# Altium schematic sheet CLAVIER.SchDoc
size A
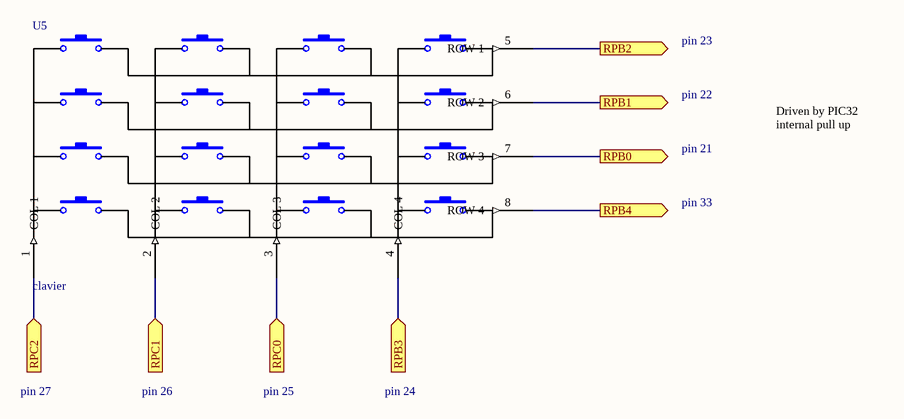
[diagram p0: CLAVIER.SchDoc]

## Parts
U5  clavier  [keypad]

## Ports
RPB0 (out), RPB1 (out), RPB2 (out), RPB3 (in), RPB4 (out), RPC0 (in), RPC1 (in), RPC2 (in)

## Nets
RPB0: U5.7(ROW_3) ; port RPB0
RPB1: U5.6(ROW_2) ; port RPB1
RPB2: U5.5(ROW_1) ; port RPB2
RPB3: U5.4(COL_4) ; port RPB3
RPB4: U5.8(ROW_4) ; port RPB4
RPC0: U5.3(COL_3) ; port RPC0
RPC1: U5.2(COL_2) ; port RPC1
RPC2: U5.1(COL_1) ; port RPC2

## Notes on the sheet
- pin 23
- pin 22
- Driven by PIC32
  internal pull up
- pin 21
- pin 33
- pin 27
- pin 26
- pin 25
- pin 24

## Library data of the parts
U5 = clavier: FABRIQUANT: MULTICOMP; FOURNISSEUR: FARNELL; REF FABRIQUANT: MCAK1604NBWB; REF FOURNISSEUR: 1182239